# Altium schematic sheet DSDPLC_MCU.SchDoc
size A3
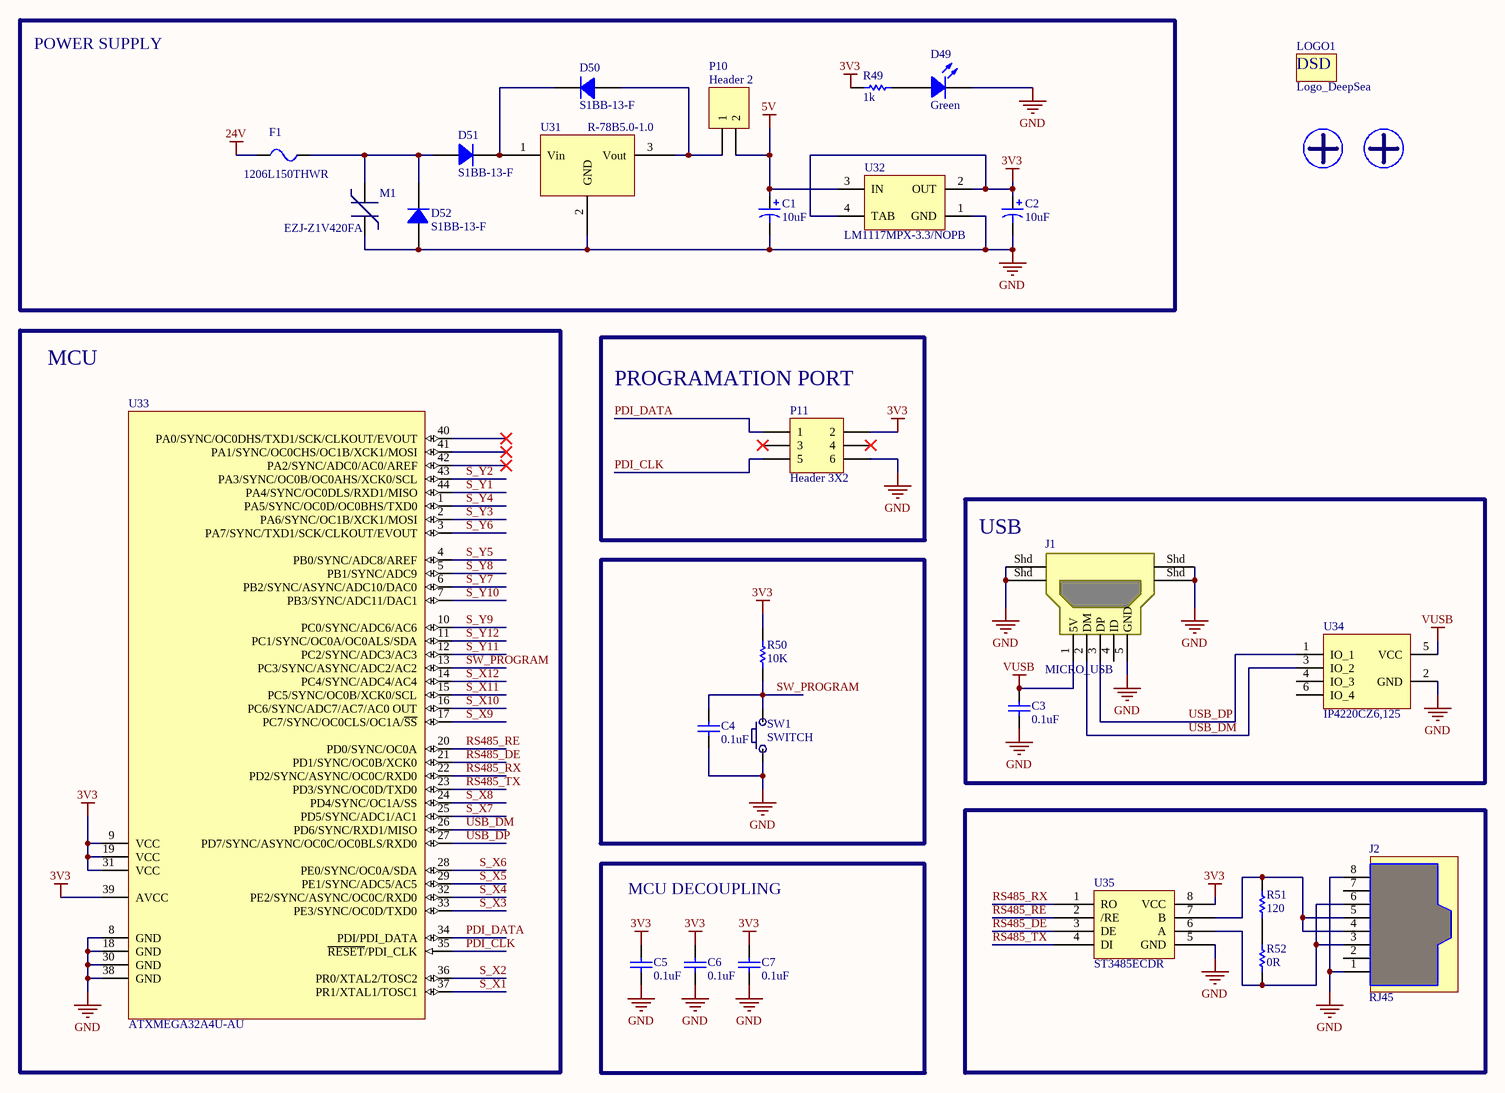
[diagram p0: DSDPLC_MCU.SchDoc]

## Parts
C1  10uF  [C_TANT_A_3216_N]
C2  10uF  [C_TANT_A_3216_N]
C3  0.1uF  [C0603_N]
C4  0.1uF  [C0603_N]
C5  0.1uF  [C0603_N]
C6  0.1uF  [C0603_N]
C7  0.1uF  [C0603_N]
D49  Green  [R0603_N]
D50  S1BB-13-F  [SMB_N]
D51  S1BB-13-F  [SMB_N]
D52  S1BB-13-F  [SMB_N]
F1  1206L150THWR  [R1206_N]
J1  MICRO_USB  [USB_MICRO_SMD]
J2  RJ45  [rj45]
LOGO1  Logo_DeepSea  [DeepSea_logo1]
M1  EZJ-Z1V420FA  [R0603_N]
M2  MountingHole-1/8in  [MoutingHole-1/8in]  (value not drawn)
M3  MountingHole-1/8in  [MoutingHole-1/8in]  (value not drawn)
P10  Header 2  [HDR1X2]
P11  Header 3X2  [HDR2X3]
R49  value 1k  [R0603_N]  (hidden comment: R_SMD)
R50  10K  [R0603_N]
R51  120  [R0603_N]
R52  0R  [R0603_N]
SW1  SWITCH  [swich_foot]
U31  R-78B5.0-1.0  [SIP3_RECOM]
U32  LM1117MPX-3.3/NOPB  [MP04A_N]
U33  ATXMEGA32A4U-AU  [44A_N]
U34  IP4220CZ6,125  [SOT457_N]
U35  ST3485ECDR  [SOIC8WA_N]

## Blocks framed on the sheet
POWER SUPPLY: C1 C2 D49-D52 F1 M1 P10 R49 U31 U32

## Nets
3V3: C2.1 C5.2 C6.2 C7.2 P11.2 R49.1 R50.2 U32.2(OUT) U32.4(TAB) U33.9(VCC) U33.19(VCC) U33.31(VCC) U33.39(AVCC) U35.8(VCC)
5V: C1.1 P10.2 U32.3(IN)
24V: F1.1
GND: C1.2 C2.2 C3.1 C4.2 C5.1 C6.1 C7.1 D49.2(K) D52.1(A) J1.5(GND) J1.Shd J2.1 J2.8 M1.2 P11.6 SW1.1 U31.2(GND) U32.1(GND) U33.8(GND) U33.18(GND) U33.30(GND) U33.38(GND) U34.2(GND) U35.5(GND)
VUSB: C3.2 J1.1(5V) U34.5(VCC)
PDI_CLK: P11.5 U33.35(~{RESET}/PDI_CLK)
PDI_DATA: P11.1 U33.34(PDI/PDI_DATA)
RS485_DE: U33.21(PD1/SYNC/OC0B/XCK0) U35.3(DE)
RS485_RE: U33.20(PD0/SYNC/OC0A) U35.2(/RE)
RS485_RX: U33.22(PD2/SYNC/ASYNC/OC0C/RXD0) U35.1(RO)
RS485_TX: U33.23(PD3/SYNC/OC0D/TXD0) U35.4(DI)
S_X1: U33.37(PR1/XTAL1/TOSC1)
S_X2: U33.36(PR0/XTAL2/TOSC2)
S_X3: U33.33(PE3/SYNC/OC0D/TXD0)
S_X4: U33.32(PE2/SYNC/ASYNC/OC0C/RXD0)
S_X5: U33.29(PE1/SYNC/ADC5/AC5)
S_X6: U33.28(PE0/SYNC/OC0A/SDA)
S_X7: U33.25(PD5/SYNC/ADC1/AC1)
S_X8: U33.24(PD4/SYNC/OC1A/SS)
S_X9: U33.17(PC7/SYNC/OC0CLS/OC1A/~{SS})
S_X10: U33.16(PC6/SYNC/ADC7/AC7/AC0_OUT)
S_X11: U33.15(PC5/SYNC/OC0B/XCK0/SCL)
S_X12: U33.14(PC4/SYNC/ADC4/AC4)
S_Y1: U33.44(PA4/SYNC/OC0DLS/RXD1/MISO)
S_Y2: U33.43(PA3/SYNC/OC0B/OC0AHS/XCK0/SCL)
S_Y3: U33.2(PA6/SYNC/OC1B/XCK1/MOSI)
S_Y4: U33.1(PA5/SYNC/OC0D/OC0BHS/TXD0)
S_Y5: U33.4(PB0/SYNC/ADC8/AREF)
S_Y6: U33.3(PA7/SYNC/TXD1/SCK/CLKOUT/EVOUT)
S_Y7: U33.6(PB2/SYNC/ASYNC/ADC10/DAC0)
S_Y8: U33.5(PB1/SYNC/ADC9)
S_Y9: U33.10(PC0/SYNC/ADC6/AC6)
S_Y10: U33.7(PB3/SYNC/ADC11/DAC1)
S_Y11: U33.12(PC2/SYNC/ADC3/AC3)
S_Y12: U33.11(PC1/SYNC/OC0A/OC0ALS/SDA)
SW_PROGRAM: C4.1 R50.1 SW1.2 U33.13(PC3/SYNC/ASYNC/ADC2/AC2)
USB_DM: J1.2(DM) U33.26(PD6/SYNC/RXD1/MISO) U34.3(IO_2)
USB_DP: J1.3(DP) U33.27(PD7/SYNC/ASYNC/OC0C/OC0BLS/RXD0) U34.1(IO_1)
NetD49_1: D49.1(A) R49.2
NetD50_1: D50.1(A) P10.1 U31.3(Vout)
NetD50_2: D50.2(K) D51.2(K) U31.1(Vin)
NetD51_1: D51.1(A) D52.2(K) F1.2 M1.1
NetJ2_3: J2.3 J2.6 R52.1 U35.6(A)
NetJ2_4: J2.4 J2.5 R51.2 U35.7(B)
NetR51_1: R51.1 R52.2

Not connected (* = marked no-connect by the designer): J1 4(ID); J2 2 7; P11 3* 4*; U33 40(PA0/SYNC/OC0DHS/TXD1/SCK/CLKOUT/EVOUT)* 41(PA1/SYNC/OC0CHS/OC1B/XCK1/MOSI)* 42(PA2/SYNC/ADC0/AC0/AREF)*; U34 4(IO_3) 6(IO_4)

## Notes on the sheet
- MCU
- (near P11) PROGRAMATION PORT
- (near J1) USB
- MCU DECOUPLING
- (in symbol Logo_DeepSea) DSD

## Library data of the parts
C1 C2 = CP_SMD: Value: 10uF
C3-C7 = C_SMD: Value: 0.1uF
D49 = LED_SMD: Color: Green
D50-D52 = S1BB-13-F: DIODE GEN PURPOSE 100V 1A SMB; Manufacturer: Diodes Incorporated; Diode Type: Standard; Voltage - Forward (Vf) (Max) @ If: 1.1V @ 1A; Speed: Standard Recovery >500ns, > 200mA (Io); Reverse Recovery Time (trr): 3µs; Current - Reverse Leakage @ Vr: 5µA @ 100V; Capacitance @ Vr, F: 10pF @ 4V, 1MHz; Supplier 1: Digi-Key; Manufacturer Part Number: S1BB-13-F; RoHS: RoHS Compliant; Category: Discrete Semiconductor Products; Stock 1: 11988; Pricing 1: 1=0.43, 10=0.306, 25=0.2416, 100=0.1836, 250=0.13004, 500=0.10404, 1000=0.078 (USD); Packaging: Cut Tape (CT); Voltage - DC Reverse (Vr) (Max): 100V; Current - Average Rectified (Io): 1A; Mounting Type: Surface Mount; Package / Case: DO-214AA, SMB; Supplier Device Package: SMB; Operating Temperature - Junction: -65°C ~ 150°C; ComponentLink1URL: http://www.diodes.com/datasheets/ds16003.pdf; ComponentLink1Description: http://www.diodes.com/datasheets/ds16003.pdf; Supplier Part Number 1: S1BB-FDICT-ND
F1 = 1206L150THWR: FUSE PTC RESET 8V 1.50A 1206; Manufacturer: Littelfuse Inc; Current - Max: 100A; Current - Hold (Ih) (Max): 1.5A; Current - Trip (It): 3A; R Min/Max: 0.040 ~ 0.120 Ohm; Time to Trip: 0.3s; Supplier 1: Digi-Key; Manufacturer Part Number: 1206L150THWR; RoHS: RoHS Compliant; Category: Circuit Protection; Stock 1: 8140; Pricing 1: 1=0.49, 10=0.462, 25=0.4256, 50=0.3892, 100=0.3234, 250=0.294, 500=0.2492, 1000=0.2198 (USD); Packaging: Cut Tape (CT); Voltage - Max: 8V; Package / Case: 1206 (3216 Metric), Concave, Long Side Terminals; ComponentLink1URL: http://www.littelfuse.com/~/media/electronics/datasheets/resettable_ptcs/littelfuse_ptc_1206l_datasheet.pdf.pdf; ComponentLink1Description: http://www.littelfuse.com/~/media/electronics/datasheets/resettable_ptcs/littelfuse_ptc_1206l_datasheet.pdf.pdf; Supplier Part Number 1: F3372CT-ND
J1 = MICRO_USB: CONN USB MICRO B RECPT SMT R/A; Manufacturer: FCI; Manufacturer Part Number: 10118194-0001LF; Connector Type: USB - micro B; Number of Contacts: 5; Gender: Receptacle; Specifications: USB 2.0; Supplier 1: Digi-Key; RoHS: RoHS Compliant; Category: Connectors, Interconnects; Stock 1: 9139; Pricing 1: 1=0.46, 10=0.433, 25=0.3712, 50=0.3156, 100=0.3032, 250=0.27224, 500=0.25988 (USD); Packaging: Cut Tape (CT); Mounting Type: Surface Mount, Right Angle, Horizontal; Features: Shielded, Solder Retention; Ingress Protection: -; ComponentLink1URL: http://portal.fciconnect.com/Comergent//fci/drawing/10118194.pdf; ComponentLink1Description: http://portal.fciconnect.com/Comergent//fci/drawing/10118194.pdf; Supplier Part Number 1: 609-4618-1-ND
J2 = RJ45: CONN MOD JACK R/A 8P8C SHIELDED; Manufacturer: TE Connectivity; Manufacturer Part Number: 5555153-1; Number of Positions/Contacts: 8p8c (RJ45, Ethernet); Number of Ports: 1; Ratings: Cat3; LED Color: Does Not Contain LED; Tab Direction: Down; Supplier 1: Digi-Key; RoHS: RoHS Compliant; Category: Connectors, Interconnects; Stock 1: 4543; Pricing 1: 1=1.82, 10=1.649, 50=1.481, 100=1.4136, 250=1.279, 500=1.17804, 1000=1.00974, 2500=0.94242, 5000=0.8953 (USD); Packaging: Tray; Connector Type: Jack; Number of Rows: 1; Mounting Type: Through Hole; Orientation: 90° Angle (Right); Termination: Solder; Shielding: Shielded; Features: Board Lock, Panel Stops; Ingress Protection: -; Contact Material: Phosphor Bronze; Contact Finish: Gold; Contact Finish Thickness: 50µin (1.27µm); Housing Material: Polybutylene Terephthalate (PBT), Polyester; Operating Temperature: -40°C ~ 85°C; ComponentLink1URL: http://www.te.com/commerce/DocumentDelivery/DDEController?Action=srchrtrv&DocNm=5555153&DocType=Customer+Drawing&DocLang=English; ComponentLink1Description: http://www.te.com/commerce/DocumentDelivery/DDEController?Action=srchrtrv&DocNm=5555153&DocType=Customer+Drawing&DocLang=English; Supplier Part Number 1: A31438-ND
M1 = EZJ-Z1V420FA: VARISTOR 42V 15A 0603; Manufacturer: Panasonic Electronic Components; Number of Circuits: 1; Maximum DC Volts: 30VDC; Supplier 1: Digi-Key; Manufacturer Part Number: EZJ-Z1V420FA; RoHS: RoHS Compliant; Category: Circuit Protection; Stock 1: 5765; Pricing 1: 1=0.35, 10=0.195, 100=0.1203, 500=0.09778, 1000=0.08797 (USD); Packaging: Cut Tape (CT); Varistor Voltage (Min): 42V; Current - Surge: 15A; Maximum AC Volts: -; Energy: -; Package / Case: 0603 (1608 Metric); ComponentLink1URL: http://industrial.panasonic.com/www-cgi/jvcr13pz.cgi?E+PZ+3+AWC0002+EZJZ1V420FA+7+WW; ComponentLink1Description: http://industrial.panasonic.com/www-cgi/jvcr13pz.cgi?E+PZ+3+AWC0002+EZJZ1V420FA+7+WW; Supplier Part Number 1: P13699CT-ND
P10 = Header 2: Header, 2-Pin; LatestRevisionDate: 17-Jul-2002; LatestRevisionNote: Re-released for DXP Platform.; Publisher: Altium Limited
P11 = Header 3X2: Header, 3-Pin, Dual row; LatestRevisionDate: 17-Jul-2002; LatestRevisionNote: Re-released for DXP Platform.; Publisher: Altium Limited
R50-R52 = R_SMD
  R50: Value: 10K
  R51: Value: 120
  R52: Value: 0R
SW1 = SWITCH: SWITCH TACTILE SPST-NO 0.05A 12V; Manufacturer: TE Connectivity; Manufacturer Part Number: FSM4JSMATR; Switch Function: Off-Mom; Contact Rating @ Voltage: 0.05A @ 12VDC; Actuator Type: Standard; Actuator Height off PCB, from Pins: 5.00mm; Actuator Orientation: Top Actuated; Outline: 6.00mm x 6.00mm; Illumination: Non-Illuminated; Operating Force: 160gf; Actuator Material: Polyphenylene Sulfide (PPS); Switch Travel: 0.25mm; Mechanical Life: 100,000 Cycles; Supplier 1: Digi-Key; RoHS: RoHS Compliant; Category: Switches; Stock 1: 33712; Pricing 1: 1=0.23, 10=0.223, 25=0.2136, 50=0.2038, 100=0.1843, 250=0.1698, 500=0.15524 (USD); Packaging: Cut Tape (CT); Circuit: SPST-NO; Mounting Type: Surface Mount; Termination Style: Gull Wing; Illumination Voltage (Nominal): -; Illumination Type, Color: -; Ingress Protection: -; Features: -; Operating Temperature: -35°C ~ 85°C; ComponentLink1URL: http://www.te.com/commerce/DocumentDelivery/DDEController?Action=srchrtrv&DocNm=2-1437565-7&DocType=Customer+Drawing&DocLang=English; ComponentLink1Description: http://www.te.com/commerce/DocumentDelivery/DDEController?Action=srchrtrv&DocNm=2-1437565-7&DocType=Customer+Drawing&DocLang=English; Supplier Part Number 1: 450-1759-1-ND
U31 = R-78B5.0-1.0: CONV DC/DC 1A 5V OUT SIP VERT; Manufacturer: Recom Power; Power (Watts) - Manufacture Series: 5W; Number of Outputs: 1; Voltage - Input (Min): 6.5V; Voltage - Input (Max): 32V; Efficiency: 93%; Supplier 1: Digi-Key; Manufacturer Part Number: R-78B5.0-1.0; RoHS: RoHS Compliant; Category: Power Supplies - Board Mount; Stock 1: 2864; Pricing 1: 1=8.45, 5=8.384, 10=8.32, 42=8.1919, 84=7.93595, 126=7.16802, 250=7.04 (USD); Packaging: Tube; Type: Linear Regulator Replacement; Voltage - Output 1: 5V; Voltage - Output 2: -; Voltage - Output 3: -; Current - Output (Max): 1A; Voltage - Isolation: -; Features: OTP, SCP; Mounting Type: Through Hole; Package / Case: 3-SIP Module; Size / Dimension: 0.45" L x 0.33" W x 0.69" H (11.5mm x 8.5mm x 17.5mm); Operating Temperature: -40°C ~ 85°C; Power (Watts) - Max: 5W; ComponentLink1URL: http://www.recom-power.com/pdf/Innoline/R-78Bxx-1.0_L.pdf; ComponentLink1Description: http://www.recom-power.com/pdf/Innoline/R-78Bxx-1.0_L.pdf; Supplier Part Number 1: 945-1052-ND
U32 = LM1117MPX-3.3/NOPB: 800mA Low-Dropout Linear Regulator, 4-pin SOT-223, Pb-Free; Manufacturer: National Semiconductor; PackageTopMarking: XYTT*N05A; PowerWise: N; CompType: LDO IC; Published: 1-Mar-2010; DatasheetVersion: Apr-2006; PackageVersion: revB, Apr-2003; PackageReference: MP04A; Publisher: Altium Limited; PackageDescription: Molded SOT-223, 6.50 x 3.56 x 1.6mm Body, 4 Lead, 2.3mm Pitch; Supplier 1: Digi-Key; Supplier Part Number 1: LM1117MPX-3.3TR-ND; Supplier 2: Digi-Key; Supplier Part Number 2: LM1117MPX-3.3CT-ND; Supplier 3: Digi-Key; Supplier Part Number 3: LM1117MPX-3.3DKR-ND; PartNumber: LM1117MPX-3.3/NOPB; RoHS: Y; PinCount: 4; Code_JEDEC: TO-261-AA; Code_IPC: SOT223-4; ComponentLink1Description: LM1117 Datasheet; ComponentLink1URL: http://www.national.com/ds/LM/LM1117.pdf; ComponentLink2Description: LM1117 Web Page; ComponentLink2URL: http://www.national.com/pf/LM/LM1117.html; ComponentLink3Description: MP04A Package Page; ComponentLink3URL: http://www.national.com/packaging/folders/mp04a.html
U33 = ATXMEGA32A4U-AU: IC MCU 8BIT 32KB FLASH 44TQFP; Manufacturer: Atmel; Core Processor: AVR; Core Size: 8/16-Bit; Speed: 32MHz; Connectivity: I²C, IrDA, SPI, UART/USART, USB; Peripherals: Brown-out Detect/Reset, DMA, POR, PWM, WDT; Number of I /O: 34; Program Memory Size: 32KB (16K x 16); EEPROM Size: 2K x 8; RAM Size: 4K x 8; Voltage - Supply (Vcc/Vdd): 1.6 V ~ 3.6 V; Data Converters: A/D 12x12b, D/A 2x12b; Oscillator Type: Internal; Supplier 1: Digi-Key; RoHS: RoHS Compliant; Category: Integrated Circuits (ICs); Stock 1: 2077; Pricing 1: 1=3.43, 25=2.1548, 100=1.9152 (USD); Packaging: Tray; Program Memory Type: FLASH; Operating Temperature: -40°C ~ 85°C; Package / Case: 44-TQFP; ComponentLink1URL: http://www.atmel.com/Images/Atmel-8387-8-and16-bit-AVR-Microcontroller-XMEGA-A4U_Datasheet.pdf; ComponentLink1Description: http://www.atmel.com/Images/Atmel-8387-8-and16-bit-AVR-Microcontroller-XMEGA-A4U_Datasheet.pdf; Supplier Part Number 1: ATXMEGA32A4U-AU-ND; Manufacturer Part Number: ATXMEGA32A4U-AU
U34 = IP4220CZ6,125: IC USB DUAL ESD PROTECT 6TSOP; Manufacturer: NXP Semiconductors; Voltage - Working: 5.5V; Number of Circuits: 4; Supplier 1: Digi-Key; Manufacturer Part Number: IP4220CZ6,125; RoHS: RoHS Compliant; Category: Circuit Protection; Stock 1: 1333; Pricing 1: 1=0.54, 10=0.42, 25=0.3544, 100=0.2888, 250=0.2392, 500=0.1976, 1000=0.148 (USD); Packaging: Cut Tape (CT); Voltage - Clamping: -; Technology: Mixed Technology; Power (Watts): -; Applications: USB; Package / Case: SC-74, SOT-457; Supplier Device Package: 6-TSOP; ComponentLink1URL: http://www.nxp.com/documents/data_sheet/IP4220CZ6.pdf; ComponentLink1Description: http://www.nxp.com/documents/data_sheet/IP4220CZ6.pdf; Supplier Part Number 1: 568-3529-1-ND
U35 = ST3485ECDR: TXRX RS485/422 3.3V ESD 8-SOIC; Manufacturer: STMicroelectronics; Protocol: RS422, RS485; Number of Drivers/Receivers: 1/1; Duplex: Half; Receiver Hysteresis: 70mV; Data Rate: 15Mbps; Voltage - Supply: 3 V ~ 3.6 V; Supplier 1: Digi-Key; Manufacturer Part Number: ST3485ECDR; RoHS: RoHS Compliant; Category: Integrated Circuits (ICs); Stock 1: 2539; Pricing 1: 1=2.44, 10=2.206, 25=1.9764, 100=1.7772, 250=1.578, 500=1.37884, 1000=1.11899 (USD); Packaging: Cut Tape (CT); Type: Transceiver; Operating Temperature: 0°C ~ 70°C; Mounting Type: Surface Mount; Package / Case: 8-SOIC (0.154", 3.90mm Width); Supplier Device Package: 8-SO; ComponentLink1URL: http://www.st.com/web/en/resource/technical/document/datasheet/CD00003137.pdf; ComponentLink1Description: http://www.st.com/web/en/resource/technical/document/datasheet/CD00003137.pdf; Supplier Part Number 1: 497-6540-1-ND